# EAGLE design minimatrixV1-2 (EAGLE 5.11)
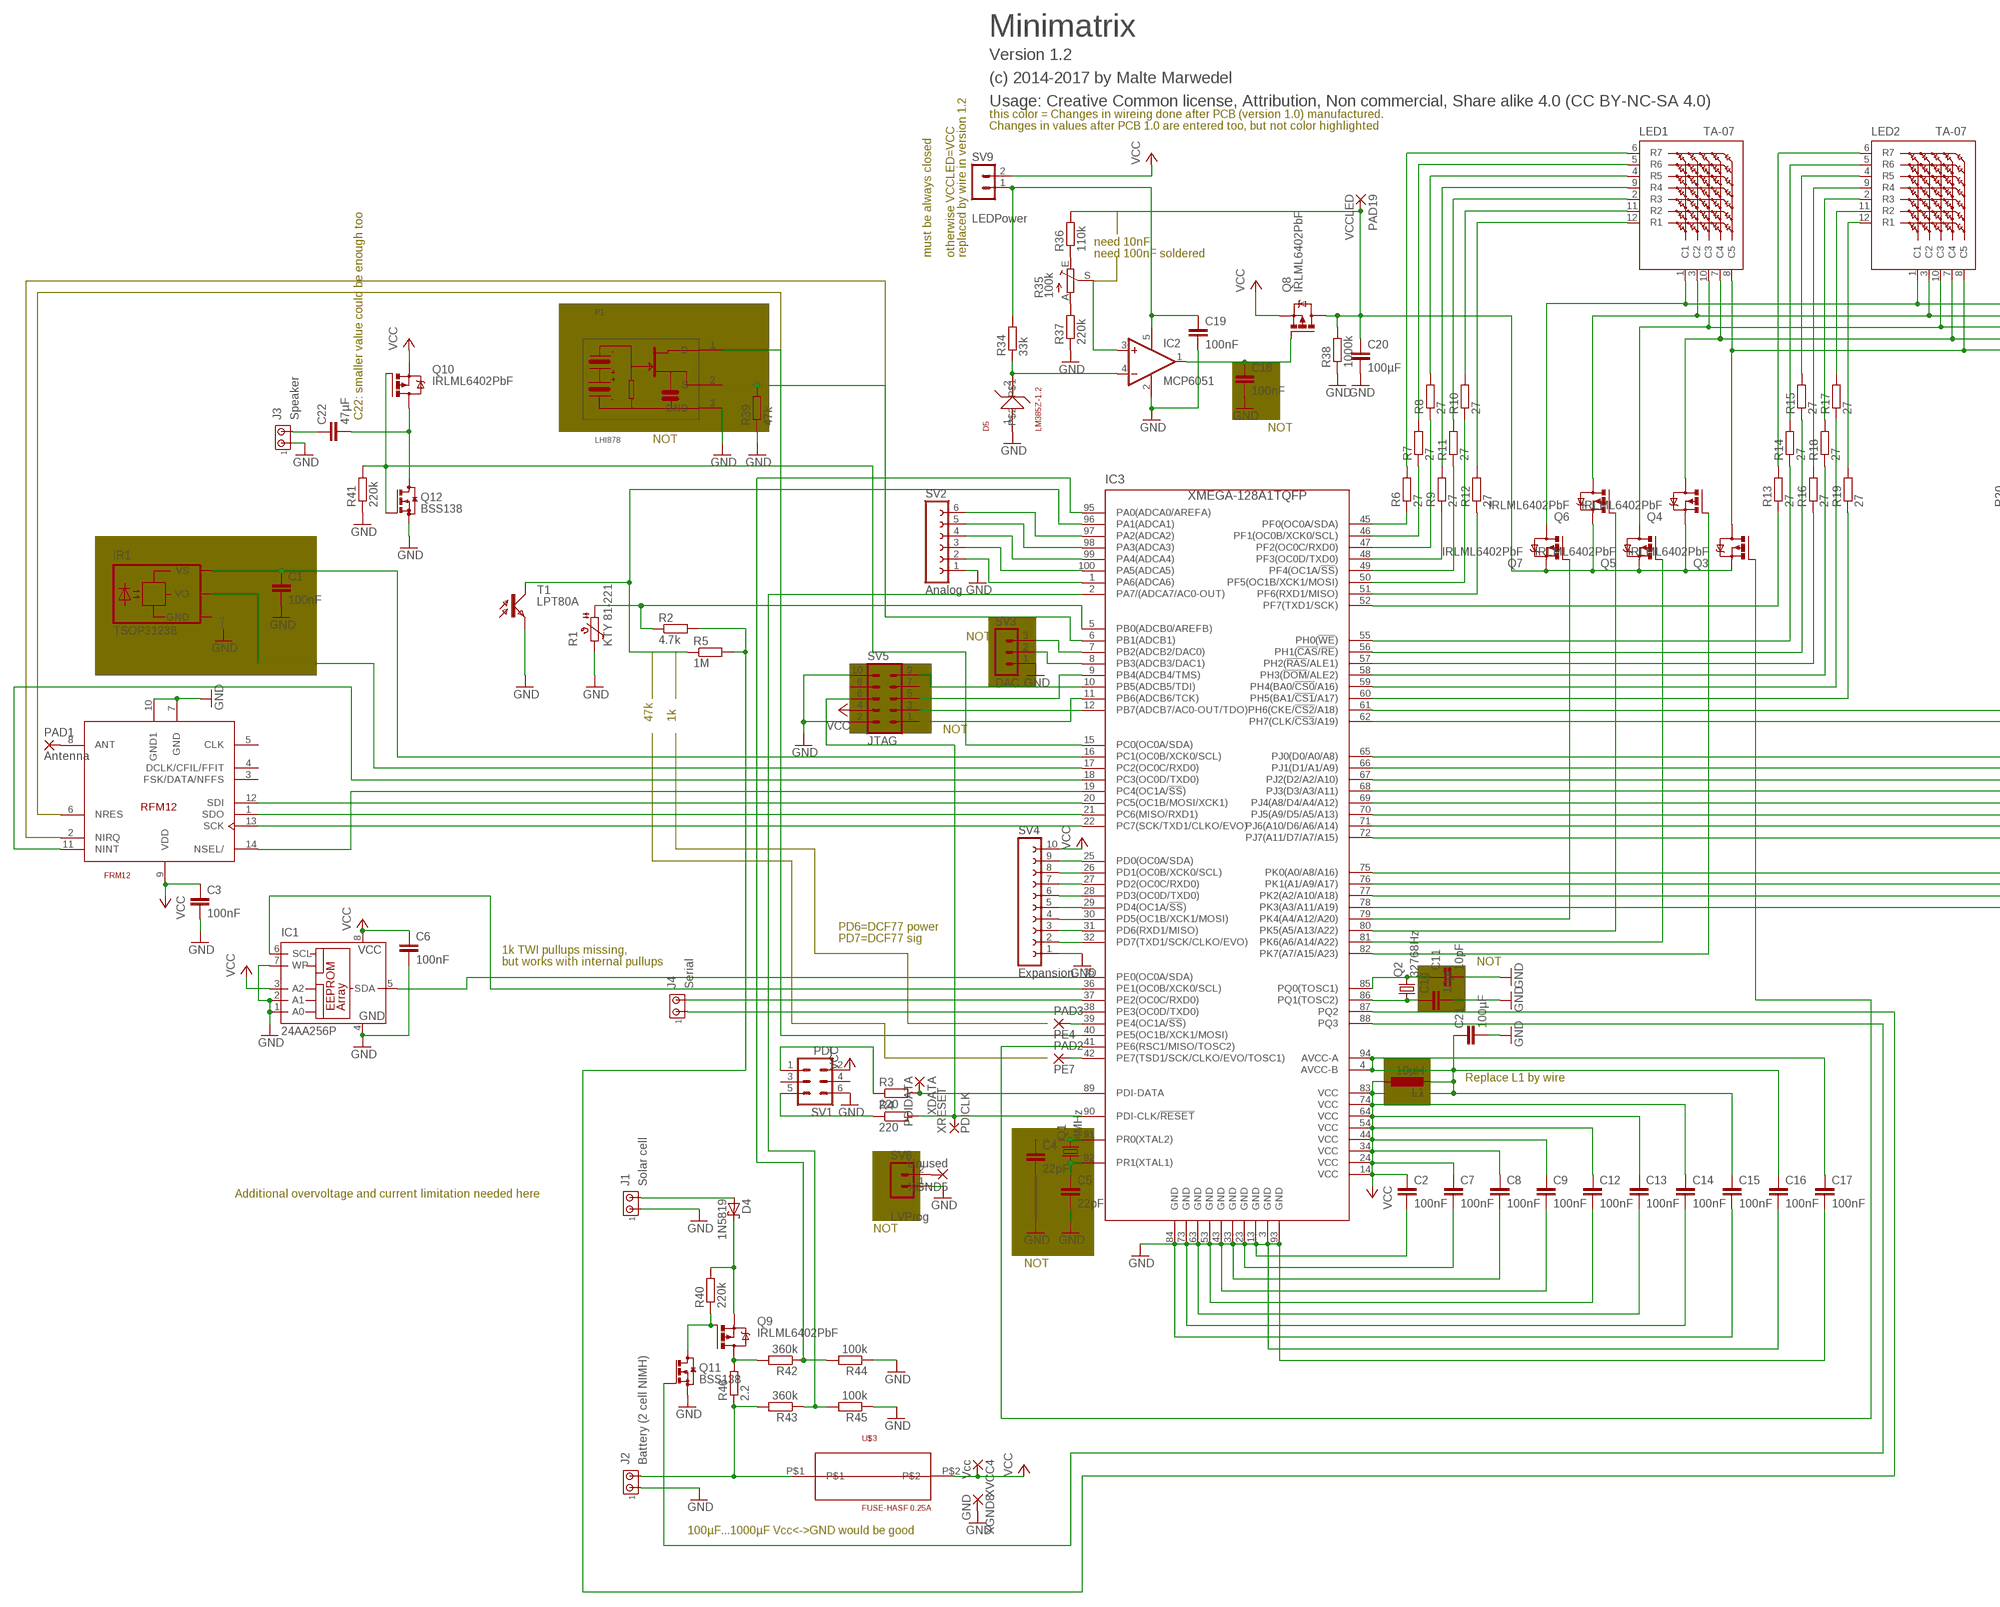
[diagram p0: schematic, sheet 1, part 1 of 2]
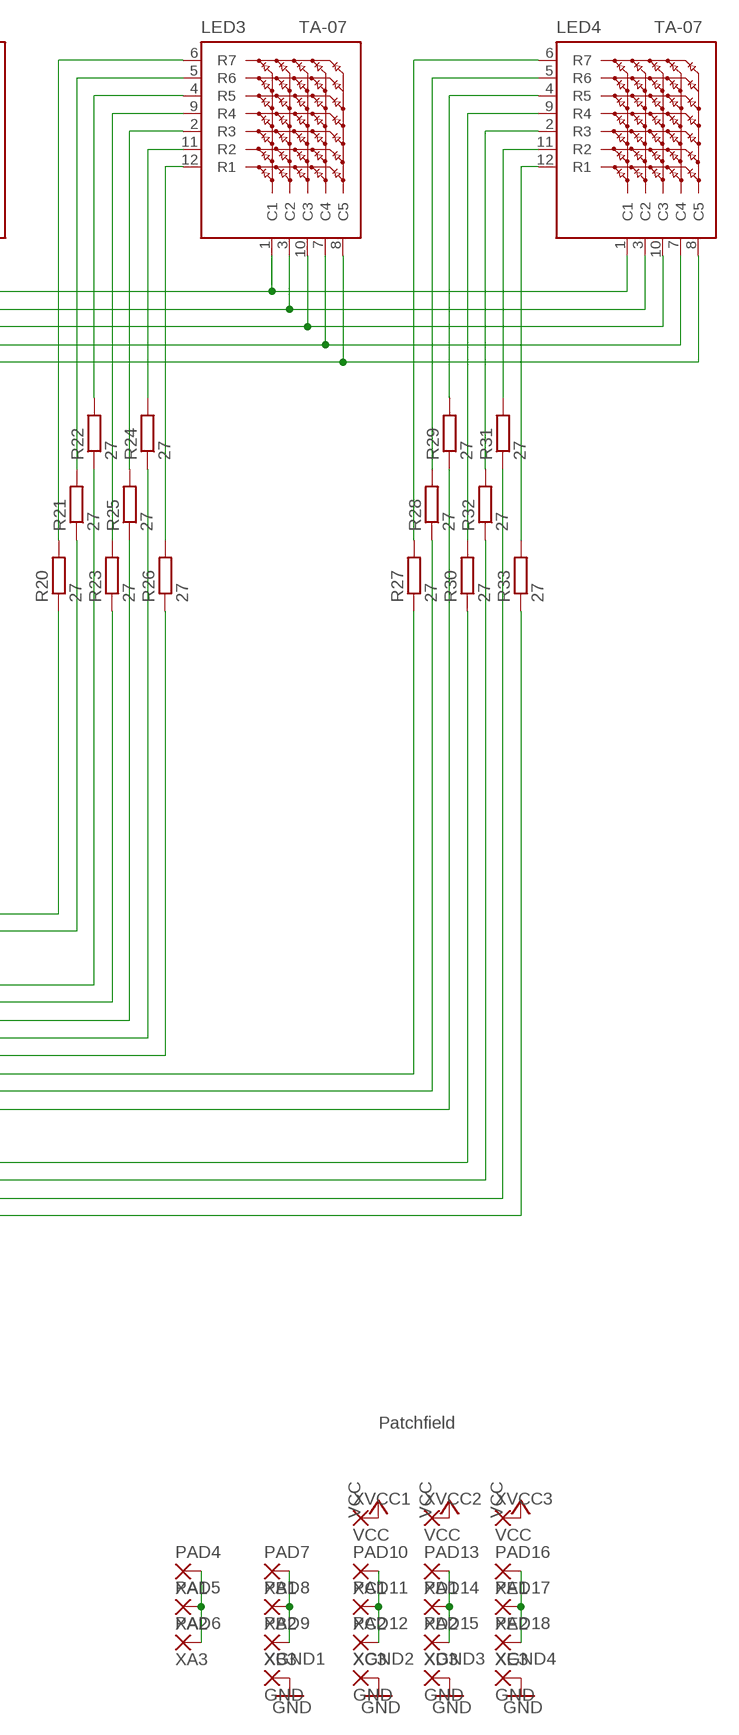
[diagram p1: schematic, sheet 1, part 2 of 2]

## Parts
C1  100nF  C-EUC0805  [C0805]
C2  100nF  C-EUC0805  [C0805]
C3  100nF  C-EUC0805  [C0805]
C4  22pF  C-EUC0805  [C0805]
C5  22pF  C-EUC0805  [C0805]
C6  100nF  C-EUC0805  [C0805]
C7  100nF  C-EUC0805  [C0805]
C8  100nF  C-EUC0805  [C0805]
C9  100nF  C-EUC0805  [C0805]
C10  10pF  C-EUC0805  [C0805]
C11  10pF  C-EUC0805  [C0805]
C12  100nF  C-EUC0805  [C0805]
C13  100nF  C-EUC0805  [C0805]
C14  100nF  C-EUC0805  [C0805]
C15  100nF  C-EUC0805  [C0805]
C16  100nF  C-EUC0805  [C0805]
C17  100nF  C-EUC0805  [C0805]
C18  100nF  C-EUC0805  [C0805]
C19  100nF  C-EUC0805  [C0805]
C20  100µF  C-EUC1206  [C1206]
C21  100µF  C-EUC1206  [C1206]
C22  47µF  C-EUC1206  [C1206]
D4  1N5819  1N5817-B  [DO41-7.6]
D5  LM385Z-1.2  LM258Z  [TO92L]
IC1  24AA256P  [DIL8]
IC2  MCP6051  MCP601OT  [SOT23-5]
IC3  XMEGA-128A1TQFP  XMEGA-A1TQFP  [TQFP100]
IR1  TSOP31238  TSOP17TB1HIGH  [TSOP17_ST]
J1  Solar cell  MTA02-100  [RM3.5X02MTA]
J2  Battery (2 cell NIMH)  MTA02-100  [RM3.5X02MTA]
J3  Speaker  MTA02-100  [RM3.5X02MTA]
J4  Serial  MTA02-100  [RM3.5X02MTA]
L1  10µH  L-EU0207/2V  [0207/2V]
LED1  TA-07  [TX07-11]
LED2  TA-07  [TX07-11]
LED3  TA-07  [TX07-11]
LED4  TA-07  [TX07-11]
P1  LHI878  [TO5]
PAD1  Antenna  1,6/0,8  [1,6/0,8]
PAD2  PE7  1,6/0,8  [1,6/0,8]
PAD3  PE4  1,6/0,8  [1,6/0,8]
PAD4  XA1  1,6/0,8  [1,6/0,8]
PAD5  XA2  1,6/0,8  [1,6/0,8]
PAD6  XA3  1,6/0,8  [1,6/0,8]
PAD7  XB1  1,6/0,8  [1,6/0,8]
PAD8  XB2  1,6/0,8  [1,6/0,8]
PAD9  XB3  1,6/0,8  [1,6/0,8]
PAD10  XC1  1,6/0,8  [1,6/0,8]
PAD11  XC2  1,6/0,8  [1,6/0,8]
PAD12  XC3  1,6/0,8  [1,6/0,8]
PAD13  XD1  1,6/0,8  [1,6/0,8]
PAD14  XD2  1,6/0,8  [1,6/0,8]
PAD15  XD3  1,6/0,8  [1,6/0,8]
PAD16  XE1  1,6/0,8  [1,6/0,8]
PAD17  XE2  1,6/0,8  [1,6/0,8]
PAD18  XE3  1,6/0,8  [1,6/0,8]
PAD19  VCCLED  1,6/0,8  [1,6/0,8]
Q1  4MHz  CRYSTALHC18U-V  [HC18U-V]
Q2  32768Hz  CRYSTALTC38H  [TC38H]
Q3  IRLML6402PbF  IRLML5203  [MICRO3]
Q4  IRLML6402PbF  IRLML5203  [MICRO3]
Q5  IRLML6402PbF  IRLML5203  [MICRO3]
Q6  IRLML6402PbF  IRLML5203  [MICRO3]
Q7  IRLML6402PbF  IRLML5203  [MICRO3]
Q8  IRLML6402PbF  IRLML5203  [MICRO3]
Q9  IRLML6402PbF  IRLML5203  [MICRO3]
Q10  IRLML6402PbF  IRLML5203  [MICRO3]
Q11  BSS138  BSS123  [SOT23]
Q12  BSS138  BSS123  [SOT23]
R1  KTY 81-221  PTC-SOD70  [SOD70]
R2  4.7k  R-EU_R0805  [R0805]
R3  220  R-EU_R0805  [R0805]
R4  220  R-EU_R0805  [R0805]
R5  1M  R-EU_R0805  [R0805]
R6  27  R-EU_R0805  [R0805]
R7  27  R-EU_R0805  [R0805]
R8  27  R-EU_R0805  [R0805]
R9  27  R-EU_R0805  [R0805]
R10  27  R-EU_R0805  [R0805]
R11  27  R-EU_R0805  [R0805]
R12  27  R-EU_R0805  [R0805]
R13  27  R-EU_R0805  [R0805]
R14  27  R-EU_R0805  [R0805]
R15  27  R-EU_R0805  [R0805]
R16  27  R-EU_R0805  [R0805]
R17  27  R-EU_R0805  [R0805]
R18  27  R-EU_R0805  [R0805]
R19  27  R-EU_R0805  [R0805]
R20  27  R-EU_R0805  [R0805]
R21  27  R-EU_R0805  [R0805]
R22  27  R-EU_R0805  [R0805]
R23  27  R-EU_R0805  [R0805]
R24  27  R-EU_R0805  [R0805]
R25  27  R-EU_R0805  [R0805]
R26  27  R-EU_R0805  [R0805]
R27  27  R-EU_R0805  [R0805]
R28  27  R-EU_R0805  [R0805]
R29  27  R-EU_R0805  [R0805]
R30  27  R-EU_R0805  [R0805]
R31  27  R-EU_R0805  [R0805]
R32  27  R-EU_R0805  [R0805]
R33  27  R-EU_R0805  [R0805]
R34  33k  R-EU_R0805  [R0805]
R35  100k  TRIM_EU-CA6H  [CA6H]
R36  110k  R-EU_R0805  [R0805]
R37  220k  R-EU_R0805  [R0805]
R38  1000k  R-EU_R0805  [R0805]
R39  47k  R-EU_R0805  [R0805]
R40  220k  R-EU_R0805  [R0805]
R41  220k  R-EU_R0805  [R0805]
R42  360k  R-EU_R0805  [R0805]
R43  360k  R-EU_R0805  [R0805]
R44  100k  R-EU_R0805  [R0805]
R45  100k  R-EU_R0805  [R0805]
R46  2.2  R-EU_0414/15  [0414/15]
SV1  PDI  MA03-2  [MA03-2]
SV2  Analog  FE06-1  [FE06]
SV3  DAC  MA03-1  [MA03-1]
SV4  Expansion  FE10-1  [FE10]
SV5  JTAG  MA05-2  [MA05-2]
SV8  LVProg  MA02-1  [MA02-1]
SV9  LEDPower  MA02-1  [MA02-1]
T1  LPT80A  [LPT80A]
U$2  FRM12  [RFM12]
U$3  FUSE-HASF 0.25A  FUSE-HASF  [FUSE-SMD-HASF]
XDATA  PDIDATA  1,6/0,8  [1,6/0,8]
XGND1  GND  1,6/0,8  [1,6/0,8]
XGND2  GND  1,6/0,8  [1,6/0,8]
XGND3  GND  1,6/0,8  [1,6/0,8]
XGND4  GND  1,6/0,8  [1,6/0,8]
XGND5  Unused  1,6/0,8  [1,6/0,8]
XGND8  GND  1,6/0,8  [1,6/0,8]
XRESET  PDICLK  1,6/0,8  [1,6/0,8]
XVCC1  VCC  1,6/0,8  [1,6/0,8]
XVCC2  VCC  1,6/0,8  [1,6/0,8]
XVCC3  VCC  1,6/0,8  [1,6/0,8]
XVCC4  Vcc  1,6/0,8  [1,6/0,8]

## Nets
GND: C1.2 C2.2 C3.2 C4.2 C5.2 C6.2 C7.2 C8.2 C9.2 C10.2 C11.2 C12.2 C13.2 C14.2 C15.2 C16.2 C17.2 C18.2 C19.2 C20.2 C21.2 D5.1 IC1.1(A0) IC1.2(A1) IC1.4(GND) IC1.7(WP) IC2.2(V-) IC3.3(GND) IC3.13(GND) IC3.23(GND) IC3.33(GND) IC3.43(GND) IC3.53(GND) IC3.63(GND) IC3.73(GND) IC3.84(GND) IC3.93(GND) IR1.GND J1.1 J2.1 J3.1 P1.3(GND) Q11.2(S) Q12.2(S) R1.2 R37.1 R38.1 R39.1 R41.1 R44.1 R45.1 SV1.6 SV2.1 SV3.1 SV4.1 SV5.2 SV5.10 SV8.1 T1.E U$2.7(GND) U$2.10(GND1) XGND1.1(P) XGND2.1(P) XGND3.1(P) XGND4.1(P) XGND8.1(P)
N$1: IC3.20(PC5(OC1B/MOSI/XCK1)) U$2.12(SDI)
N$2: IC3.21(PC6(MISO/RXD1)) U$2.1(SDO)
N$3: IC3.22(PC7(SCK/TXD1/CLKO/EVO)) U$2.13(SCK)
N$4: IC3.19(PC4(OC1A/!SS!)) U$2.14(NSEL/)
N$5: IC3.18(PC3(OC0D/TXD0)) U$2.11(NINT)
N$6: C1.1 IC3.16(PC1(OC0B/XCK0/SCL)) IR1.VS
N$7: PAD1.1(P) U$2.8(ANT)
N$8: IC3.17(PC2(OC0C/RXD0)) IR1.VO
N$9: R3.1 SV1.1
N$10: IC3.89(PDI-DATA) R3.2 XDATA.1(P)
N$11: IC3.87(PQ2) R2.2 R5.2
N$12: C4.1 IC3.91(PR0(XTAL2)) Q1.2
N$13: C5.1 IC3.92(PR1(XTAL1)) Q1.1
N$14: IC3.79(PK4(A4/A12/A20)) Q7.1(G)
N$15: IC1.5(SDA) IC3.35(PE0(OC0A/SDA))
N$16: IC1.6(SCL) IC3.36(PE1(OC0B/XCK0/SCL))
N$17: IC3.5(PB0(ADCB0/AREFB)) R1.1 R2.1
N$18: IC3.90(PDI-CLK/!RESET) R4.2 SV5.6 XRESET.1(P)
N$19: R4.1 SV1.5
N$20: C11.1 IC3.85(PQ0(TOSC1)) Q2.2
N$21: C10.1 IC3.86(PQ1(TOSC2)) Q2.1
N$22: IC3.97(PA2(ADCA2)) SV2.6
N$23: IC3.98(PA3(ADCA3)) SV2.5
N$24: IC3.99(PA4(ADCA4)) SV2.4
N$25: IC3.100(PA5(ADCA5)) SV2.3
N$26: IC3.1(PA6(ADCA6)) SV2.2
N$27: IC3.96(PA1(ADCA1)) R5.1 T1.C
N$28: LED1.1(C1) LED2.1(C1) LED3.1(C1) LED4.1(C1) Q7.3(D)
N$29: IC3.9(PB4(ADCB4/TMS)) SV5.5
N$30: IC3.10(PB5(ADCB5/TDI)) SV5.9
N$31: IC3.11(PB6(ADCB6/TCK)) SV5.1
N$32: IC3.12(PB7(ADCB7/AC0-OUT/TDO)) SV5.3
N$33: LED1.3(C2) LED2.3(C2) LED3.3(C2) LED4.3(C2) Q6.3(D)
N$34: LED1.10(C3) LED2.10(C3) LED3.10(C3) LED4.10(C3) Q5.3(D)
N$35: LED1.7(C4) LED2.7(C4) LED3.7(C4) LED4.7(C4) Q4.3(D)
N$36: LED1.8(C5) LED2.8(C5) LED3.8(C5) LED4.8(C5) Q3.3(D)
N$37: LED1.6(R7) R6.2
N$38: LED1.5(R6) R7.2
N$39: LED1.4(R5) R8.2
N$40: LED1.9(R4) R9.2
N$41: LED1.2(R3) R11.2
N$42: LED1.11(R2) R10.2
N$43: LED1.12(R1) R12.2
N$44: IC3.50(PF5(OC1B/XCK1/MOSI)) R10.1
N$45: IC3.48(PF3(OC0D/TXD0)) R9.1
N$46: IC3.46(PF1(OC0B/XCK0/SCL)) R7.1
N$47: IC3.45(PF0(OC0A/SDA)) R6.1
N$48: IC3.47(PF2(OC0C/RXD0)) R8.1
N$49: IC3.49(PF4(OC1A/!SS!)) R11.1
N$50: IC3.51(PF6(RXD1/MISO)) R12.1
N$51: LED2.6(R7) R13.2
N$52: LED2.5(R6) R14.2
N$53: LED2.4(R5) R15.2
N$54: LED2.9(R4) R16.2
N$55: LED2.2(R3) R18.2
N$56: LED2.11(R2) R17.2
N$57: LED2.12(R1) R19.2
N$58: IC3.59(PH4(BA0/!CS0!/A16)) R17.1
N$59: IC3.57(PH2(!RAS!/ALE1)) R16.1
N$60: IC3.55(PH0(!WE!)) R14.1
N$61: IC3.52(PF7(TXD1/SCK)) R13.1
N$62: IC3.56(PH1(!CAS!/!RE!)) R15.1
N$63: IC3.58(PH3(!DOM!/ALE2)) R18.1
N$64: IC3.60(PH5(BA1/!CS1!/A17)) R19.1
N$65: J2.2 R43.2 R46.1 U$3.P$1
N$66: LED3.6(R7) R20.2
N$67: LED3.5(R6) R21.2
N$68: LED3.4(R5) R22.2
N$69: LED3.9(R4) R23.2
N$70: LED3.2(R3) R25.2
N$71: LED3.11(R2) R24.2
N$72: LED3.12(R1) R26.2
N$73: IC3.68(PJ3(D3/A3/A11)) R24.1
N$74: IC3.66(PJ1(D1/A1/A9)) R23.1
N$75: IC3.62(PH7(CLK/!CS3!/A19)) R21.1
N$76: IC3.61(PH6(CKE/!CS2!/A18)) R20.1
N$77: IC3.65(PJ0(D0/A0/A8)) R22.1
N$78: IC3.67(PJ2(D2/A2/A10)) R25.1
N$79: IC3.69(PJ4(A8/D4/A4/A12)) R26.1
N$80: LED4.6(R7) R27.2
N$81: LED4.5(R6) R28.2
N$82: LED4.4(R5) R29.2
N$83: LED4.9(R4) R30.2
N$84: LED4.2(R3) R32.2
N$85: LED4.11(R2) R31.2
N$86: LED4.12(R1) R33.2
N$87: IC3.77(PK2(A2/A10/A18)) R31.1
N$88: IC3.75(PK0(A0/A8/A16)) R30.1
N$89: IC3.71(PJ6(A10/D6/A6/A14)) R28.1
N$90: IC3.70(PJ5(A9/D5/A5/A13)) R27.1
N$91: IC3.72(PJ7(A11/D7/A7/A15)) R29.1
N$92: IC3.76(PK1(A1/A9/A17)) R32.1
N$93: IC3.78(PK3(A3/A11/A19)) R33.1
N$94: D4.A J1.2
N$95: IC3.80(PK5(A5/A13/A22)) Q6.1(G)
N$96: C20.1 PAD19.1(P) Q3.2(S) Q4.2(S) Q5.2(S) Q6.2(S) Q7.2(S) Q8.3(D) R36.2 R38.2
N$97: IC3.81(PK6(A6/A14/A22)) Q5.1(G)
N$98: IC3.82(PK7(A7/A15/A23)) Q4.1(G)
N$99: IC3.41(PE6(RSC1/MISO/TOSC2)) Q3.1(G)
N$100: C18.1 IC2.1(OUT) Q8.1(G)
N$101: D5.2 IC2.4(-IN) R34.1
N$102: R35.E R36.1
N$103: R35.A R37.2
N$104: IC3.6(PB1(ADCB1)) P1.2(S) R39.2
N$105: IC2.3(+IN) R35.S
N$106: IC3.40(PE5(OC1B/XCK1/MOSI)) P1.1(D)
N$107: IC3.25(PD0(OC0A/SDA)) SV4.9
N$108: IC3.26(PD1(OC0B/XCK0/SCL)) SV4.8
N$109: IC3.27(PD2(OC0C/RXD0)) SV4.7
N$110: IC3.28(PD3(OC0D/TXD0)) SV4.6
N$111: IC3.29(PD4(OC1A/!SS!)) SV4.5
N$112: IC3.30(PD5(OC1B/XCK1/MOSI)) SV4.4
N$113: IC3.31(PD6(RXD1/MISO)) SV4.3
N$114: IC3.32(PD7(TXD1/SCK/CLKO/EVO)) SV4.2
N$115: D4.C Q9.2(S) R40.2
N$116: Q9.1(G) Q11.3(D) R40.1
N$117: Q9.3(D) R42.2 R46.2
N$118: IC3.2(PA7/(ADCA7/AC0-OUT)) R43.1 R45.2
N$119: IC3.95(PA0(ADCA0/AREFA)) R42.1 R44.2
N$120: IC3.37(PE2(OC0C/RXD0)) J4.2
N$121: IC3.38(PE3(OC0D/TXD0)) J4.1
N$122: IC3.42(PE7(TSD1/SCK/CLKO/EVO/TOSC1)) PAD2.1(P)
N$123: IC3.88(PQ3) Q11.1(G)
N$124: C22.2 Q10.3(D) Q12.3(D)
N$125: IC3.15(PC0(OC0A/SDA)) Q10.1(G) Q12.1(G) R41.2
N$126: C22.1 J3.2
N$127: IC3.39(PE4(OC1A/!SS!)) PAD3.1(P)
N$128: IC3.7(PB2(ADCB2/DAC0)) SV3.3
N$129: IC3.8(PB3(ADCB3/DAC1)) SV3.2
N$131: SV8.2 XGND5.1(P)
N$132: C19.1 IC2.5(V+) R34.2 SV9.1
N$156: PAD4.1(P) PAD5.1(P) PAD6.1(P)
N$157: PAD7.1(P) PAD8.1(P) PAD9.1(P)
N$158: PAD10.1(P) PAD11.1(P) PAD12.1(P)
N$159: PAD13.1(P) PAD14.1(P) PAD15.1(P)
N$160: PAD16.1(P) PAD17.1(P) PAD18.1(P)
VCC: C2.1 C3.1 C6.1 C7.1 C8.1 C9.1 C12.1 C13.1 C14.1 C15.1 C16.1 C17.1 C21.1 IC1.3(A2) IC1.8(VCC) IC3.4(AVCC-B) IC3.14(VCC) IC3.24(VCC) IC3.34(VCC) IC3.44(VCC) IC3.54(VCC) IC3.64(VCC) IC3.74(VCC) IC3.83(VCC) IC3.94(AVCC-A) L1.1 L1.2 Q8.2(S) Q10.2(S) SV1.2 SV4.10 SV5.4 SV9.2 U$2.9(VDD) U$3.P$2 XVCC1.1(P) XVCC2.1(P) XVCC3.1(P) XVCC4.1(P)
Unconnected: SV1.3 SV1.4 SV5.7 SV5.8 U$2.2(NIRQ) U$2.3(FSK/DATA/NFFS) U$2.4(DCLK/CFIL/FFIT) U$2.5(CLK) U$2.6(NRES)

## Notes on the sheet
- Minimatrix
- Version 1.2
- (c) 2014-2017 by Malte Marwedel
- Usage: Creative Common license, Attribution, Non commercial, Share alike 4.0 (CC BY-NC-SA 4.0)
- this color = Changes in wireing done after PCB (version 1.0) manufactured.
- Changes in values after PCB 1.0 are entered too, but not color highlighted
- need 10nF
- must be always closed | otherwise VCCLED=VCC | replaced by wire in version 1.2 | need 100nF soldered
- C22: smaller value could be enough too
- NOT
- NOT
- NOT
- 47k | 1k
- NOT
- PD6=DCF77 power
- PD7=DCF77 sig
- 1k TWI pullups missing,
- but works with internal pullups | NOT
- Patchfield
- Replace L1 by wire
- Additional overvoltage and current limitation needed here
- NOT
- NOT
- 100µF...1000µF Vcc<->GND would be good

## Library data of the parts
C1-C22 = rcl:C-EU: CAPACITOR, European symbol
D4 = diode:1N581*: 1.0A SCHOTTKY BARRIER RECTIFIER Source: http://www.diodes.com/datasheets/ds23001.pdf
D5 = maltes2_lib:LM258Z: LM185Z / LM285Z / LM385Z Micropower voltage reference diode LM285Z-1.2 -> 1,25V ref voltage.
IC1 = microchip:24*: Serial EEPROM I2C; MF: MICROCHIP; MPN: 24AA256-I/P; OC_FARNELL: 1331294; OC_NEWARK: 92C6872
IC2 = linear:MCP601: Single Op Amp 2.7V to 6.0V Single Supply CMOS Source: http://ww1.microchip.com/downloads/en/DeviceDoc/21314g.pdf
IC3 = avr-7:XMEGA-A1: Atmel XMega A1 Series processor
IR1 = maltes_lib:TSOP17*TB1: TSOP17..TB1 IR Receiver Modules for Remote Control Systems Source: http://www.vishay.com/docs/82042/82042.pdf
J1-J4 = maltes2_lib:MTA02-100: AMP connector; OC_FARNELL: unknown; OC_NEWARK: unknown
L1 = rcl:L-EU: INDUCTOR, European symbol
LED1-LED4 = maltes2_lib:TA-07: 18mm (0.7 INCH) 5x7 DOT MATRIX DISPLAY
P1 = maltes2_lib:LHI878: LHI 878 PIR Sensor
PAD1-PAD19 XDATA XGND1-XGND5 XGND8 XRESET XVCC1-XVCC4 = wirepad:1,6/0,8: THROUGH-HOLE PAD
Q1 Q2 = crystal:CRYSTAL: CRYSTAL; OC_FARNELL: unknown; OC_NEWARK: unknown
Q3-Q10 = transistor-power:IRLML5203: HEXFET P-Channel Power MOSFET
Q11 Q12 = transistor-small-signal:BSS123: N-CHANNEL MOS FET
R1 = ptc-ntc:PTC-: Positive Temperature Coefficient Resistor (PTC) termistor Philips KTY81-210 - KTY81-252 Source: 153627-da-01-en-Temperatur-Sensor_KTY10-6_Philips.pdf; OC_FARNELL: unknown; OC_NEWARK: unknown
R2-R34 R36-R46 = rcl:R-EU_: RESISTOR, European symbol
R35 = maltes2_lib:TRIM_EU-: POTENTIOMETER
SV1 = con-lstb:MA03-2: PIN HEADER; OC_FARNELL: unknown; OC_NEWARK: unknown
SV2 = con-lsta:FE06-1: FEMALE HEADER; OC_FARNELL: unknown; OC_NEWARK: unknown
SV3 = con-lstb:MA03-1: PIN HEADER; OC_FARNELL: unknown; OC_NEWARK: unknown
SV4 = con-lsta:FE10-1: FEMALE HEADER; OC_FARNELL: unknown; OC_NEWARK: unknown
SV5 = con-lstb:MA05-2: PIN HEADER; OC_FARNELL: unknown; OC_NEWARK: unknown
SV8 SV9 = maltes_lib:MA02-1: PIN HEADER
T1 = opto-trans-siemens:LPT80A: PHOTO TRANSISTOR; OC_FARNELL: unknown; OC_NEWARK: unknown
U$2 = RFM12:FRM12
U$3 = maltes_lib:FUSE-HASF

## Board
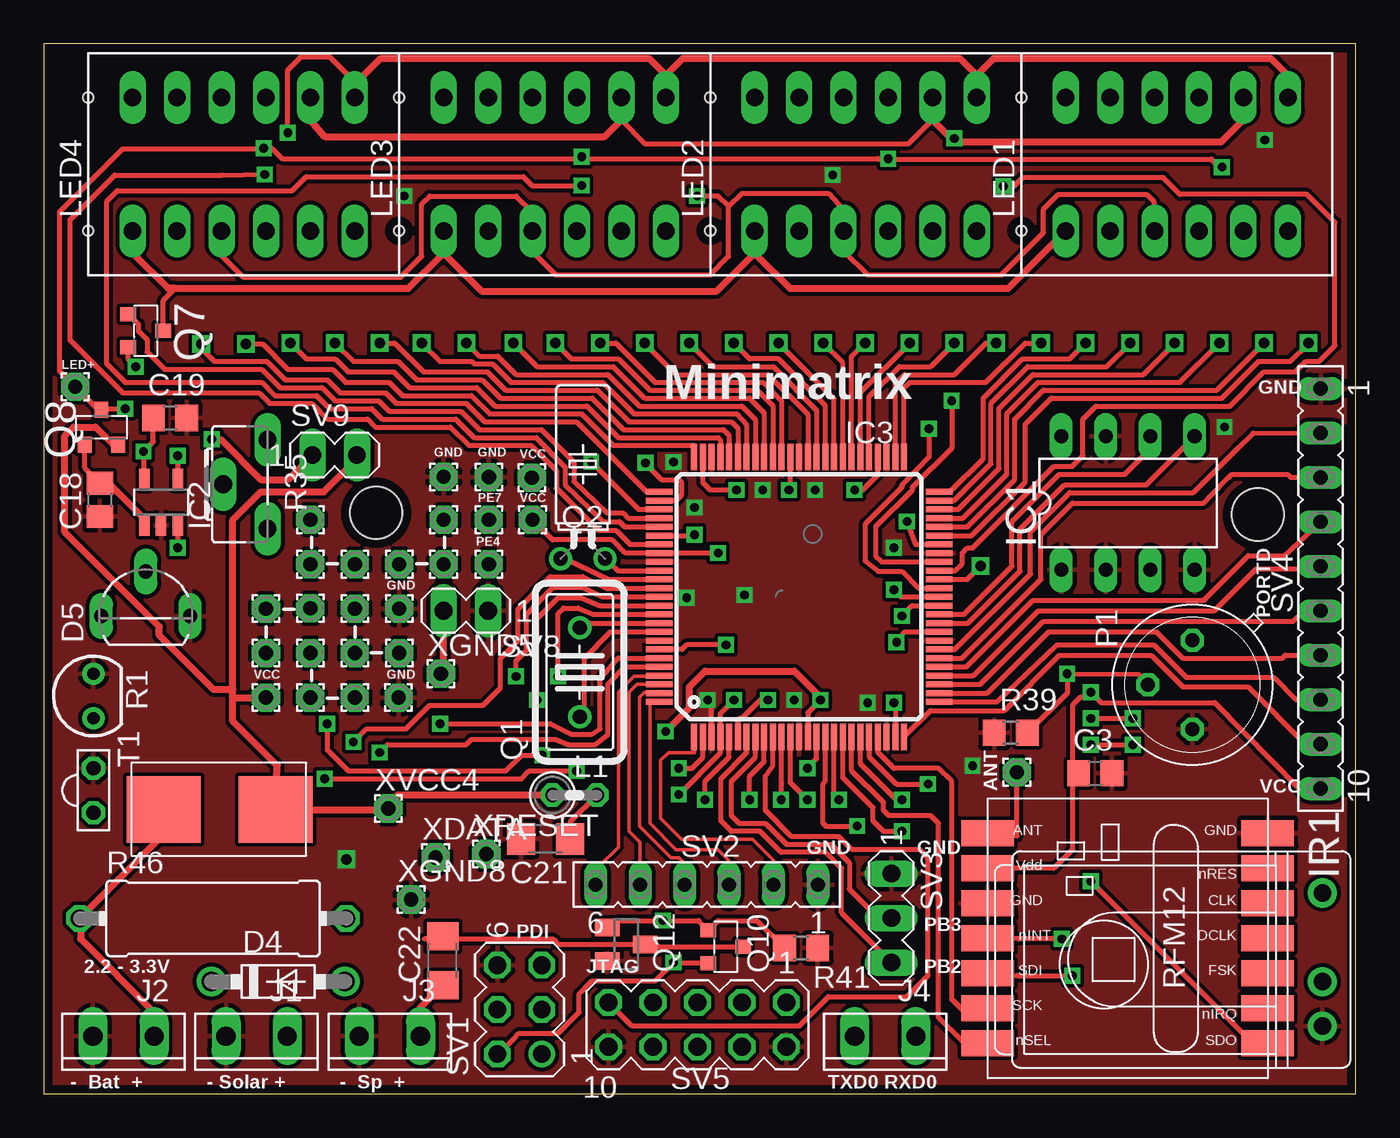
[diagram p2: board, top side]
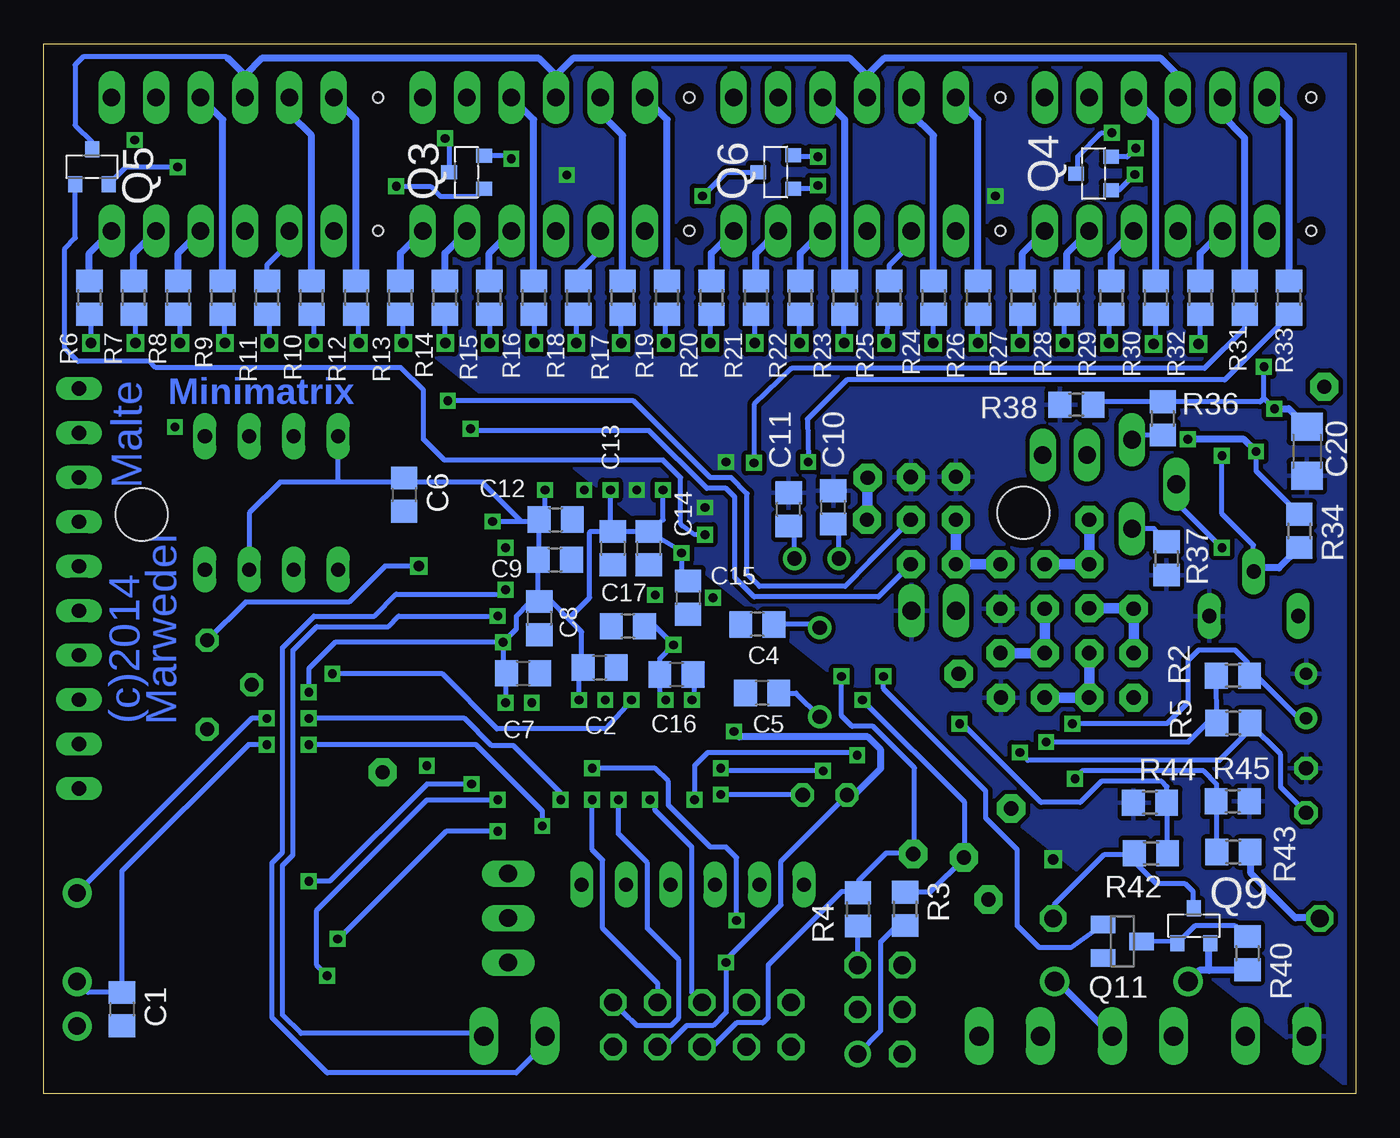
[diagram p3: board, bottom side, seen from below]

Size 75 x 60 mm. Coordinates in mm from the lower left corner, seen from the top.
Outline: 0,0 75,0 75,60 0,60 0,0
Copper layers (1*16): Top 0.035mm / dielectric 1.5mm / Bottom 0.035mm
Design rules "myDefaultThin-2014-01-16": minimum track width 0.2mm, minimum drill 0.3mm, track to track 0.15mm, track to pad 0.15mm, pad to pad 0.15mm, via to via 0.2mm, smd to smd 0.15mm, copper to edge 0.5mm, drill to drill 1mm, minimum pad ring 10mil, minimum via ring 8mil, stop-mask expansion 4mil, vias tented up to drill 0mil, thermal gap 10mil
Holes 3 mm at 69.4,33.1 19,33.2

### Footprints (pad centres in the part's own frame; a part is rotated, then mirrored left to right if it is on the bottom)
C0805 = smd 1.3 x 1.5: 1 -0.95,0; 2 0.95,0
C1206 = smd 1.6 x 1.8: 1 -1.4,0; 2 1.4,0
DO41-7.6 = drill 1.1 pad 1.7 round: A 3.81,0; C -3.81,0
TO92L = drill 0.813 long: 1 0,-2.54; 2 2.54,0; 3 0,2.54
DIL8 = drill 0.813 long: 1 -3.81,-3.81; 2 -1.27,-3.81; 3 1.27,-3.81; 4 3.81,-3.81; 5 3.81,3.81; 6 1.27,3.81; 7 -1.27,3.81; 8 -3.81,3.81
SOT23-5 = smd 0.6 x 1.2: 1 -0.95,-1.306; 2 0,-1.306; 3 0.95,-1.306; 4 0.95,1.306; 5 -0.95,1.306
TQFP100 = smd 1.5 x 0.35: 1 -8,6; 2 -8,5.5; 3 -8,5; 4 -8,4.5; 5 -8,4; 6 -8,3.5; 7 -8,3; 8 -8,2.5; 9 -8,2; 10 -8,1.5; 11 -8,1; 12 -8,0.5; 13 -8,0; 14 -8,-0.5; 15 -8,-1; 16 -8,-1.5; 17 -8,-2; 18 -8,-2.5; 19 -8,-3; 20 -8,-3.5; 21 -8,-4; 22 -8,-4.5; 23 -8,-5; 24 -8,-5.5; 25 -8,-6; 51 8,-6; 52 8,-5.5; 53 8,-5; 54 8,-4.5; 55 8,-4; 56 8,-3.5; 57 8,-3; 58 8,-2.5; 59 8,-2; 60 8,-1.5; 61 8,-1; 62 8,-0.5; 63 8,0; 64 8,0.5; 65 8,1; 66 8,1.5; 67 8,2; 68 8,2.5; 69 8,3; 70 8,3.5; 71 8,4; 72 8,4.5; 73 8,5; 74 8,5.5; 75 8,6 | smd 0.35 x 1.5: 26 -6,-8; 27 -5.5,-8; 28 -5,-8; 29 -4.5,-8; 30 -4,-8; 31 -3.5,-8; 32 -3,-8; 33 -2.5,-8; 34 -2,-8; 35 -1.5,-8; 36 -1,-8; 37 -0.5,-8; 38 0,-8; 39 0.5,-8; 40 1,-8; 41 1.5,-8; 42 2,-8; 43 2.5,-8; 44 3,-8; 45 3.5,-8; 46 4,-8; 47 4.5,-8; 48 5,-8; 49 5.5,-8; 50 6,-8; 76 6,8; 77 5.5,8; 78 5,8; 79 4.5,8; 80 4,8; 81 3.5,8; 82 3,8; 83 2.5,8; 84 2,8; 85 1.5,8; 86 1,8; 87 0.5,8; 88 0,8; 89 -0.5,8; 90 -1,8; 91 -1.5,8; 92 -2,8; 93 -2.5,8; 94 -3,8; 95 -3.5,8; 96 -4,8; 97 -4.5,8; 98 -5,8; 99 -5.5,8; 100 -6,8
TSOP17_ST = drill 1 pad 1.676 round: GND 0,-5.08; VO 0,2.54; VS 0,-2.54
RM3.5X02MTA = drill 1.1 long: 1 1.75,0; 2 -1.75,0
0207/2V = drill 0.813 octagon: 1 -1.27,0; 2 1.27,0
TX07-11 = drill 1 long: 1 -6.35,-3.81; 2 -3.81,-3.81; 3 -1.27,-3.81; 4 1.27,-3.81; 5 3.81,-3.81; 6 6.35,-3.81; 7 6.35,3.81; 8 3.81,3.81; 9 1.27,3.81; 10 -1.27,3.81; 11 -3.81,3.81; 12 -6.35,3.81 | hole 0.6: -8.89,3.81; -8.89,-3.81
TO5 = drill 0.813 octagon: 1 0,-2.54; 2 2.54,0; 3 0,2.54
1,6/0,8 = drill 0.813 pad 1.6 octagon: 1 0,0
HC18U-V = drill 0.813 round: 1 -2.54,0; 2 2.54,0
TC38H = drill 0.813 round: 1 -1.27,0; 2 1.27,0
MICRO3 = smd 0.8 x 0.9: 1 -0.95,-1; 2 0.95,-1; 3 0,1
SOT23 = smd 1 x 1.4: 1 -0.95,-1.1; 2 0.95,-1.1; 3 0,1.1
SOD70 = drill 0.7 pad 1.27 round: 1 -1.27,0; 2 1.27,0
R0805 = smd 1.3 x 1.5: 1 -0.95,0; 2 0.95,0
CA6H = drill 1.016 long: A -2.54,0; E 2.54,0; S 0,2.54
0414/15 = drill 1.016 octagon: 1 -7.62,0; 2 7.62,0
MA03-2 = drill 1.016 round: 1 -2.54,-1.27 | drill 1.016 octagon: 2 -2.54,1.27; 3 0,-1.27; 4 0,1.27; 5 2.54,-1.27; 6 2.54,1.27
FE06 = drill 0.813 long: 1 -6.35,0; 2 -3.81,0; 3 -1.27,0; 4 1.27,0; 5 3.81,0; 6 6.35,0
MA03-1 = drill 1.016 long: 1 -2.54,0; 2 0,0; 3 2.54,0
FE10 = drill 0.813 long: 1 -11.43,0; 2 -8.89,0; 3 -6.35,0; 4 -3.81,0; 5 -1.27,0; 6 1.27,0; 7 3.81,0; 8 6.35,0; 9 8.89,0; 10 11.43,0
MA05-2 = drill 1.016 octagon: 1 -5.08,-1.27; 2 -5.08,1.27; 3 -2.54,-1.27; 4 -2.54,1.27; 5 0,-1.27; 6 0,1.27; 7 2.54,-1.27; 8 2.54,1.27; 9 5.08,-1.27; 10 5.08,1.27
MA02-1 = drill 1.016 long: 1 -2.54,0; 2 0,0
LPT80A = drill 0.813 octagon: C 0,-1.27; E 0,1.27
RFM12 = smd 1.5 x 3: 1 -5,-10; 2 -3,-10; 3 -1,-10; 4 1,-10; 5 3,-10; 6 5,-10; 7 7,-10; 8 7,6; 9 5,6; 10 3,6; 11 1,6; 12 -1,6; 13 -3,6; 14 -5,6
FUSE-SMD-HASF = smd 4.24 x 3.81: P$1 -3.15,-0.05; P$2 3.24,-0.05

### Placement (x,y rotation side)
C1  70.53,4.84 270 bottom
C2  43.22,24.36 0 bottom
C3  60.11,18.32 0 top
C4  34.21,26.82 180 bottom
C5  33.93,22.9 180 bottom
C6  54.4,34.23 270 bottom
C7  47.59,24.03 0 bottom
C8  46.67,27.18 270 bottom
C9  45.78,30.52 0 bottom
C10  29.87,33.51 90 bottom
C11  32.42,33.4 90 bottom
C12  45.74,32.81 0 bottom
C13  42.47,31.18 270 bottom
C14  40.42,31.18 270 bottom
C15  38.17,28.35 270 bottom
C16  38.83,23.96 0 bottom
C17  41.6,26.72 180 bottom
C18  3.21,33.94 270 top
C19  7.22,38.62 0 top
C20  2.79,36.71 270 bottom
C21  28.69,14.56 180 top
C22  22.8,7.61 90 top
D4  13.4,6.41 0 top
D5  5.83,27.3 90 top
IC1  61.98,33.76 0 top
IC2  6.71,33.8 0 top
IC3  43.18,28.39 90 top
IR1  73.09,8.94 0 top
J1  12.17,3.29 180 top
J2  4.56,3.29 180 top
J3  19.78,3.29 180 top
J4  48.1,3.29 180 top
L1  30.35,17.07 0 top
LED1  64.77,53.12 0 top
LED2  46.99,53.12 0 top
LED3  29.21,53.12 0 top
LED4  11.43,53.12 0 top
P1  65.66,23.37 180 top
PAD1  55.63,18.37 0 top
PAD2  25.44,32.8 0 top
PAD3  25.44,30.26 0 top
PAD4  17.78,22.64 0 top
PAD5  15.24,25.18 0 top
PAD6  15.24,22.64 0 top
PAD7  17.78,27.72 0 top
PAD8  17.78,25.18 0 top
PAD9  20.32,25.18 0 top
PAD10  22.86,32.8 0 top
PAD11  20.32,30.26 0 top
PAD12  22.86,30.26 0 top
PAD13  15.24,27.74 0 top
PAD14  12.7,27.72 0 top
PAD15  12.7,25.18 0 top
PAD16  15.24,30.26 0 top
PAD17  17.78,30.26 0 top
PAD18  15.24,32.8 0 top
PAD19  1.8,40.4 0 top
Q1  30.64,24.09 90 top
Q2  30.82,30.58 0 top
Q3  50.83,52.66 90 bottom
Q4  14.98,52.58 90 bottom
Q5  72.24,52.97 0 bottom
Q6  33.16,52.67 90 bottom
Q7  5.83,43.6 270 top
Q8  3.3,38.08 0 top
Q9  9.26,9.6 0 bottom
Q10  38.99,8.4 270 top
Q11  13.35,8.71 270 bottom
Q12  33.3,8.54 270 top
R1  2.84,22.73 90 top
R2  7.02,23.89 180 bottom
R3  25.76,10.56 90 bottom
R4  28.46,10.54 90 bottom
R5  7,21.19 180 bottom
R6  72.39,45.5 90 bottom
R7  69.85,45.5 90 bottom
R8  67.31,45.5 90 bottom
R9  64.77,45.5 90 bottom
R10  59.69,45.5 90 bottom
R11  62.23,45.5 90 bottom
R12  57.15,45.5 90 bottom
R13  54.61,45.5 90 bottom
R14  52.07,45.5 90 bottom
R15  49.53,45.5 90 bottom
R16  46.99,45.5 90 bottom
R17  41.91,45.5 90 bottom
R18  44.45,45.5 90 bottom
R19  39.37,45.5 90 bottom
R20  36.83,45.5 90 bottom
R21  34.29,45.5 90 bottom
R22  31.75,45.5 90 bottom
R23  29.21,45.5 90 bottom
R24  24.13,45.5 90 bottom
R25  26.67,45.5 90 bottom
R26  21.59,45.5 90 bottom
R27  19.05,45.5 90 bottom
R28  16.51,45.5 90 bottom
R29  13.97,45.5 90 bottom
R30  11.43,45.5 90 bottom
R31  6.35,45.5 90 bottom
R32  8.89,45.5 90 bottom
R33  3.81,45.5 90 bottom
R34  3.23,32.16 90 bottom
R35  12.79,34.83 90 top
R36  11.03,38.59 90 bottom
R37  10.82,30.59 90 bottom
R38  15.97,39.37 0 bottom
R39  55.28,20.63 0 top
R40  6.19,8.03 270 bottom
R41  43.29,8.33 180 top
R42  11.71,13.75 180 bottom
R43  7,13.82 0 bottom
R44  11.77,16.63 0 bottom
R45  7.03,16.71 180 bottom
R46  9.68,10.02 0 top
SV1  27.2,4.81 90 top
SV2  37.9,11.95 180 top
SV3  48.45,10.04 270 top
SV4  72.99,28.87 270 top
SV5  37.37,3.95 180 top
SV8  22.86,27.6 180 top
SV9  17.9,36.5 0 top
T1  2.84,17.33 0 top
U$2  59.97,7.88 90 top
U$3  10.01,16.3 0 top
XDATA  22.4,13.5 0 top
XGND1  20.32,27.72 0 top
XGND2  25.44,35.24 0 top
XGND3  22.86,35.25 0 top
XGND4  20.28,22.64 0 top
XGND5  22.7,24 0 top
XGND8  21,11.1 0 top
XRESET  25.3,13.7 0 top
XVCC1  27.9,35.2 0 top
XVCC2  27.94,32.8 0 top
XVCC3  12.7,22.64 0 top
XVCC4  19.7,16.3 0 top

### Tracks (layer width: path | path; a pad name or v marks a point on that pad's centre or on a via)
GND  (via drill 0.5, 0.6)
  Top 0.3: IC3.3 38.18,22.27 v37.95,22.5
  Bottom 0.3: v37.95,22.5 37.8,22.65 37.8,23.88 C16.2
  other vias: 53.1,18.75 42.9,22.5 47.1,22.35 48.6,31.2 44.1,34.5 41.1,34.5 36.75,28.35 40.05,28.5 37.2,33.5 36,36.1 69.8,54.5 45.1,52.5 20.6,51.3 17.3,13.4 67.5,38.1
  pour Top (isolate 0.22): 0,0 0,60 75,60 75,0
  pour Bottom (isolate 0.25): 0,60 75,60 0,0
N$1  (via drill 0.5)
  Top 0.3: v58.8,6.75 55.64,6.75 U$2.12 | IC3.20 46.68,18.87 48.75,16.8 v49.05,16.8
  Bottom 0.3: v58.8,6.75 59.4,7.35 59.4,10.5 53.1,16.8 v49.05,16.8
N$2  (via drill 0.5)
  Top 0.3: IC3.21 47.18,19.27 48.75,17.7 v50.55,17.7 | v59.85,12.15 69.15,2.85 69.1,2.85 U$2.1
  Bottom 0.3: v50.55,17.7 53.1,17.7 58.65,12.15 v59.85,12.15
N$3
  Top 0.3: IC3.22 47.68,19.52 48.6,18.6 51.15,18.6 51.9,17.85 51.9,5.4 52.5,4.8 53.6,4.8 U$2.13
N$4
  Top 0.3: U$2.14 52.5,3 51.15,4.35 51.15,15.45 50.7,15.9 48.3,15.9 48,16.2 48,16.65 46.18,18.47 IC3.19
N$5  (via drill 0.5)
  Top 0.3: v58.2,8.85 55.74,8.85 U$2.11 | IC3.18 45.68,18.07 47.4,16.35 47.4,15.6 48,15 v49.05,15
  Bottom 0.3: v49.05,15 52,15 58.2,8.8 v58.2,8.85
N$6  (via drill 0.5)
  Top 0.3: v59.85,19.95 v62.25,19.95 | IC3.16 44.68,17.87 44.55,17.7 44.55,15.45 44.7,15.3 v46.5,15.3
  Bottom 0.3: v62.25,19.95 63.3,19.95 70.53,12.72 C1.1 | IR1.VS 72.48,5.79 C1.1 | C1.1 70.8,6.06 | v59.85,19.95 50.3,19.95 46.5,16.15 v46.5,15.3
N$7
  Top 0.3: PAD1.1 55.63,14.74 U$2.8
N$8  (via drill 0.5)
  Top 0.3: v59.85,21.45 v62.25,21.45 | IC3.17 45.18,16.92 arc90 v45.45,16.8
  Bottom 0.3: v59.85,21.45 50.95,21.45 49.4,19.9 48.15,19.9 45.45,17.2 v45.45,16.8 | IR1.VO 63.12,21.45 v62.25,21.45
N$9
  Bottom 0.3: R3.1 25.95,9.77 25.95,9.9 27.15,8.7 27.15,3.59 SV1.1
N$10  (via drill 0.5)
  Top 0.3: IC3.89 31.79,27.89 30.7,28.35 29.4,28.35 28.2,27.15 v28.2,22.5
  Bottom 0.2: XDATA.1 22.35,13.5
  Bottom 0.3: R3.2 24.34,11.51 22.35,13.5 22.35,16.65 v28.2,22.5
N$11  (via drill 0.5)
  Top 0.3: IC3.87 32.14,28.89 30.8,29.55 28.95,29.55 27.1,27.7 27.1,25.9 26.1,24.9 26.1,23.2 25.1,22.2 22.05,22.2 20.7,20.85 18.45,20.85 v17.7,20.1
  Bottom 0.3: R2.2 R5.2 8.55,21.15 9.6,20.1 v17.7,20.1
N$12
  Top 0.3: IC3.91 31.2,26.89 Q1.2
  Bottom 0.3: C4.1 30.83,26.82 Q1.2
N$13
  Top 0.3: IC3.92 32.39,26.39 30.9,24.9 30.9,21.74 Q1.1
  Bottom 0.3: C5.1 31.99,22.9 Q1.1
N$14
  Top 0.3: 30.3,36.1 28.45,37.95 24.9,37.95 23.85,39 19.75,39 19.15,39.6 16.65,39.6 15.9,40.35 13.5,40.35 12.45,41.4 6.9,41.4 5.9,42.4 5.9,43.1 5.4,43.6 5.4,43.98 Q7.1 | 30.3,36.1 30.2,36.1 | 30.3,36.1 30.3,35 32.21,33.19 33.11,33.19 33.4,32.9 IC3.79
N$15
  Top 0.3: IC3.35 52.84,26.89 55.8,29.85 55.8,32.25 58.35,34.8 63.02,34.8 IC1.5
N$16
  Top 0.3: IC3.36 52.59,27.39 55.35,30.15 55.35,32.7 58.05,35.4 61.8,35.4 63.15,36.75 63.15,37.02 IC1.6
N$17  (via drill 0.5)
  Top 0.3: IC3.5 39.18,19.23 37.8,17.85 v37.8,16.8 | v28.5,19.35 27.3,19.35 26.4,18.45 17.4,18.45 16.2,19.65 v16.2,21.15
  Bottom 0.3: 37.8,16.65 v37.8,16.8 37.8,18.75 37.05,19.5 28.7,19.5 v28.5,19.35 | v16.2,21.15 10.8,21.15 9.6,22.35 9.6,24.75 9,25.35 6.9,25.35 6.15,24.6 R2.1 5.69,23.89 3.8,22 3.28,21.5 R1.1
N$18  (via drill 0.5)
  Top 0.3: IC3.90 31.41,27.39 30.55,27.75 29.7,27.75 29.4,27.45 v29.4,23.85
  Bottom 0.3: SV5.6 36.77,2.68 35.4,4.05 33.9,4.05 33.6,4.35 33.6,7.35 29.4,11.55 28.42,11.55 | 28.42,11.55 R4.2 | 28.42,11.55 28.42,12.18 26.85,13.75 25.22,13.75 25.22,13.78 | v29.4,23.85 29.4,21.6 28.8,21 27.6,21 25.22,18.62 25.22,13.78 | XRESET.1 25.22,13.78
N$19
  Bottom 0.3: SV1.5 R4.1
N$20
  Top 0.3: Q2.2 32.3,30.4 32.81,29.89 IC3.85
  Bottom 0.3: 32.79,32.23 C11.1 32.09,32.12 Q2.2
N$21
  Top 0.3: IC3.86 32.29,29.39 30,30.5 Q2.1
  Bottom 0.3: Q2.1 29.55,32.24 C10.1
N$22
  Top 0.2: SV2.6 31.8,12.2 31.8,13.05 32.85,14.1 32.85,22.95 33.75,23.85 35.14,23.85 IC3.97
N$23
  Top 0.2: SV2.5 34.09,14.36 33.45,15 33.45,22.95 33.9,23.4 IC3.98
N$24
  Top 0.2: SV2.4 36.6,11.98 36.6,13.2 36.3,13.5 35.85,13.5 34.05,15.3 34.05,22.65 34.35,22.95 35.12,22.95 IC3.99
N$25
  Top 0.2: SV2.3 39.15,11.97 39.15,13.35 38.55,13.95 36.15,13.95 34.65,15.45 34.65,22.31 IC3.100
N$26
  Top 0.2: SV2.2 41.7,13.35 40.5,14.55 36.45,14.55 35.25,15.75 35.25,19.05 35.7,19.5 37.2,19.5 37.2,20.37 IC3.1
N$27  (via drill 0.5)
  Top 0.3: IC3.96 33.24,24.39 32.25,23.4 32.25,20.55 31.5,19.95 30,19.95 29.25,20.25 24.45,20.25 24.15,19.95 19.65,19.95 v19.2,19.5
  Bottom 0.3: v19.2,19.5 18.75,19.05 7.8,19.05 6.05,20.8 6.05,21.15 | T1.C 4.3,17.52 4.3,19.4 6.05,21.15 | 6.05,21.15 R5.1
N$28
  Top 0.3: Q7.3 6.83,45.34 7.51,46.02
  Top 0.4: 22.86,48.04 20.84,46.02 7.51,46.02
  Top 0.406: LED1.1 55.13,46.02 42.66,46.02 40.64,48.04 | 40.64,48.04 LED2.1 | 40.64,48.04 38.47,45.87 25.03,45.87 22.86,48.04 LED3.1 | 7.51,46.02 7.1,46.02 5.08,48.04 LED4.1
N$29  (via drill 0.5)
  Top 0.3: v40.35,16.8 40.35,18.15 41.18,18.98 IC3.9
  Bottom 0.3: v40.35,16.8 40.05,16.5 40.05,16.2 37.95,14.1 37.95,5.8 SV5.5
N$30
  Top 0.3: SV5.9 33.6,3.9 43.2,3.9 44.85,5.55 49.35,5.55 50.55,6.75 50.55,13.5 50.1,13.95 46.2,13.95 45.45,14.7 42.75,14.7 41.25,16.2 41.25,18.15 41.68,18.73 IC3.10
N$31  (via drill 0.5)
  Top 0.3: v42.15,16.8 42.18,17.73 IC3.11
  Bottom 0.3: v42.15,16.8 42.15,14.85 40.5,13.2 40.5,9.45 38.7,7.65 38.7,4.35 39.15,3.9 41.1,3.9 41.4,4.2 41.55,4.32 SV5.1
N$32  (via drill 0.5)
  Top 0.3: IC3.12 42.68,17.77 v43.65,16.8
  Bottom 0.3: v43.65,16.8 43.65,13.95 43.05,13.35 43.05,9.45 39.9,6.3 SV5.3
N$33  (via drill 0.5)
  Top 0.3: LED4.3 10.16,47.89 11.4,46.65 20.4,46.65 21.6,47.85 21.6,50.85 22.05,51.3 27,51.3 27.9,50.4 27.9,49.35 LED3.3 28.05,49.2 28.05,48 29.25,46.8 38.1,46.8 39.15,47.85 39.15,50.7 | 39.15,50.7 39.9,51.45 44.85,51.45 45.72,50.52 LED2.3 45.72,48.18 47.1,46.8 54.75,46.8 57.15,49.2 57.15,50.55 58,51.4 63.05,51.4 63.45,51 63.45,49.36 LED1.3 | v37.35,51.3 38.55,51.3 39.15,50.7
  Bottom 0.3: Q6.3 35.98,52.67 v37.35,51.3
N$34
  Bottom 0.3: Q5.3 72.24,54.39 73.2,55.35 73.2,58.8 72.75,59.25 64.55,59.25 64.47,59.17
  Bottom 0.406: LED4.10 10.16,58.2 11.13,59.17 26.97,59.17 27.94,58.2 | 27.94,58.2 LED3.10 | 45.72,58.2 LED2.10 | 45.72,58.2 44.75,59.17 28.91,59.17 27.94,58.2 | 63.5,58.2 62.53,59.17 46.69,59.17 45.72,58.2 | 63.5,58.2 LED1.10 | 63.5,58.2 64.47,59.17
N$35  (via drill 0.5)
  Top 0.3: LED4.7 17.78,57.82 16.35,59.25 14.7,59.25 13.95,58.5 v13.95,54.91
  Top 0.4: 18,57.9 19.27,59.17 34.59,59.17
  Top 0.406: LED1.7 71.12,58.2 70.15,59.17 54.31,59.17 53.34,58.2 | 53.34,58.2 LED2.7 | 53.34,58.2 52.37,59.17 36.53,59.17 35.56,58.2 | LED4.7 17.78,57.68 18,57.9 | 35.56,58.2 LED3.7 | 34.59,59.17 35.56,58.2
  Bottom 0.3: v13.95,54.91 14.54,54.91 15.9,53.55 15.9,52.66 Q4.3
N$36  (via drill 0.5)
  Top 0.3: 52.07,54.39 v52.07,54.58 v52.06,54.59 | 33.02,55.66 33.02,55.63 34.35,54.3 49.44,54.3 50.8,55.66
  Top 0.406: LED1.8 68.58,55.66 67.31,54.39 52.07,54.39 50.8,55.66 LED2.8 | LED3.8 33.02,55.66 32.05,54.69 16.06,54.69 15.24,55.66 LED4.8
  Bottom 0.3: Q3.3 51.83,54.36 v52.06,54.59
N$37
  Bottom 0.406: R6.2 72.39,48.04 LED1.6
N$38
  Bottom 0.406: R7.2 69.85,48.04 LED1.5
N$39
  Bottom 0.406: R8.2 67.31,48.04 LED1.4
N$40
  Bottom 0.406: R9.2 64.77,55.66 LED1.9
N$41
  Bottom 0.3: R11.2 62.23,47.37 61,48.6 61,49.27 LED1.2
N$42
  Bottom 0.406: R10.2 59.69,54.76 60.9,55.95 60.9,56.87 LED1.11
N$43
  Bottom 0.406: R12.2 57.15,55.66 LED1.12
N$44  (via drill 0.6)
  Top 0.3: IC3.50 51.79,34.39 53.7,36.3 53.7,39.75 55.95,42 58.65,42 v59.55,42.9
  Bottom 0.3: v59.55,42.9 59.55,44.41 R10.1
N$45  (via drill 0.6)
  Top 0.3: IC3.48 52.29,33.39 54.6,35.7 54.6,39.15 56.55,41.1 62.85,41.1 v64.65,42.9
  Bottom 0.3: v64.65,42.9 64.65,44.43 R9.1
N$46  (via drill 0.6)
  Top 0.3: IC3.46 52.79,32.39 55.5,35.1 55.5,38.55 57.15,40.2 67.05,40.2 v69.75,42.9
  Bottom 0.3: v69.75,42.9 69.75,44.45 R7.1
N$47  (via drill 0.6)
  Top 0.3: IC3.45 53.04,31.89 56.1,34.95 56.1,38.25 57.6,39.75 67.35,39.75 69.45,41.85 71.25,41.85 v72.3,42.9
  Bottom 0.3: v72.3,42.9 72.3,44.46 R6.1
N$48  (via drill 0.6)
  Top 0.3: IC3.47 52.54,32.89 55.05,35.4 55.05,38.85 56.85,40.65 64.95,40.65 v67.2,42.9
  Bottom 0.3: v67.2,42.9 67.2,44.44 R8.1
N$49  (via drill 0.6)
  Top 0.3: IC3.49 52.04,33.89 54.15,36 54.15,39.45 56.25,41.55 60.75,41.55 v62.1,42.9
  Bottom 0.3: v62.1,42.9 62.1,44.42 R11.1
N$50  (via drill 0.6)
  Top 0.3: IC3.51 49.18,40.33 49.5,40.65 53.85,40.65 56.1,42.9 v57,42.9
  Bottom 0.3: v57,42.9 57,44.4 R12.1
N$51
  Bottom 0.406: R13.2 54.61,48.04 LED2.6
N$52
  Bottom 0.406: R14.2 52.07,48.04 LED2.5
N$53
  Bottom 0.406: R15.2 49.53,48.04 LED2.4
N$54
  Bottom 0.406: R16.2 46.99,55.66 LED2.9
N$55
  Bottom 0.3: R18.2 44.45,46.95 43.18,48.22 LED2.2
N$56
  Bottom 0.406: R17.2 41.91,54.76 43.2,56.05 43.2,56.1 LED2.11
N$57
  Bottom 0.406: R19.2 39.37,55.66 LED2.12
N$58  (via drill 0.6)
  Top 0.3: IC3.59 45.18,39.72 v42,42.9
  Bottom 0.3: v42,42.9 42,44.46 R17.1
N$59  (via drill 0.6)
  Top 0.3: IC3.57 46.18,42.13 v46.95,42.9
  Bottom 0.3: v46.95,42.9 46.95,44.51 R16.1
N$60  (via drill 0.6)
  Top 0.3: IC3.55 47.18,39.83 48.9,41.55 50.7,41.55 v52.05,42.9
  Bottom 0.3: v52.05,42.9 52.05,44.53 R14.1
N$61  (via drill 0.6)
  Top 0.3: IC3.52 48.68,40.58 49.2,41.1 52.05,41.1 53.85,42.9 v54.45,42.9
  Bottom 0.3: v54.45,42.9 54.45,44.39 R13.1
N$62  (via drill 0.6)
  Top 0.3: IC3.56 46.68,40.08 v49.5,42.9
  Bottom 0.3: v49.5,42.9 49.5,44.52 R15.1
N$63  (via drill 0.6)
  Top 0.3: IC3.58 45.68,41.77 v44.55,42.9
  Bottom 0.3: v44.55,42.9 44.55,44.45 R18.1
N$64  (via drill 0.6)
  Top 0.3: IC3.60 44.68,39.32 42,42 40.35,42 v39.45,42.9
  Bottom 0.3: v39.45,42.9 39.45,44.47 R19.1
N$65
  Top 0.4: J2.2 6.31,4.64 2.1,8.85 2.1,9.98 R46.1 | R46.1 2.18,9.9 | U$3.P$1 6.86,14.82 R46.1
  Bottom 0.4: R46.1 2.09,10.05 3.45,10.05 6,12.6 6,13.77 R43.2
N$66
  Bottom 0.406: R20.2 36.83,48.04 LED3.6
N$67
  Bottom 0.406: R21.2 34.29,48.04 LED3.5
N$68
  Bottom 0.406: R22.2 31.75,48.04 LED3.4
N$69
  Bottom 0.406: R23.2 29.21,55.66 LED3.9
N$70
  Bottom 0.3: R25.2 26.67,47.33 25.4,48.6 LED3.2
N$71
  Bottom 0.406: R24.2 24.13,54.76 25.35,55.95 25.35,56.88 LED3.11
N$72
  Bottom 0.406: R26.2 21.59,55.66 LED3.12
N$73  (via drill 0.6)
  Top 0.3: IC3.68 40.68,38.52 39.9,39.3 34.05,39.3 32.25,41.1 27,41.1 25.95,42.15 24.9,42.15 v24.15,42.9
  Bottom 0.3: v24.15,42.9 24.15,44.53 R24.1
N$74  (via drill 0.6)
  Top 0.3: IC3.66 41.68,39.32 40.8,40.2 34.65,40.2 32.85,42 30.15,42 v29.25,42.9
  Bottom 0.3: v29.25,42.9 29.25,44.51 R23.1
N$75  (via drill 0.6)
  Top 0.3: IC3.62 43.68,38.82 41.4,41.1 36.15,41.1 v34.35,42.9
  Bottom 0.3: v34.35,42.9 34.35,44.49 R21.1
N$76  (via drill 0.6)
  Top 0.3: IC3.61 44.18,39.07 41.7,41.55 38.25,41.55 v36.9,42.9
  Bottom 0.3: v36.9,42.9 36.9,44.48 R20.1
N$77  (via drill 0.6)
  Top 0.3: IC3.65 42.18,39.57 41.1,40.65 34.95,40.65 32.7,42.9 v31.8,42.9
  Bottom 0.3: v31.8,42.9 31.8,44.5 R22.1
N$78  (via drill 0.6)
  Top 0.3: IC3.67 41.18,38.92 40.35,39.75 34.35,39.75 32.55,41.55 28.2,41.55 v26.85,42.9
  Bottom 0.3: v26.85,42.9 R25.1
N$79  (via drill 0.6)
  Top 0.3: IC3.69 40.18,38.23 39.6,38.85 33.75,38.85 31.95,40.65 26.7,40.65 25.65,41.7 24.6,41.7 24.45,41.85 22.65,41.85 v21.6,42.9
  Bottom 0.3: v21.6,42.9 R26.1
N$80
  Bottom 0.406: R27.2 19.05,48.04 LED4.6
N$81
  Bottom 0.406: R28.2 16.51,48.04 LED4.5
N$82
  Bottom 0.406: R29.2 13.97,48.04 LED4.4
N$83
  Bottom 0.406: R30.2 11.43,55.66 LED4.9
N$84
  Bottom 0.406: R32.2 8.89,48.04 LED4.2
N$85
  Bottom 0.406: R31.2 6.35,54.61 7.65,55.95 7.65,56.9 LED4.11
N$86
  Bottom 0.406: R33.2 3.81,55.66 LED4.12
N$87  (via drill 0.5)
  Top 0.3: v34.4,36.05 34.4,36 35.3,35.1 36.3,35.1 36.45,34.95 36.45,34.2 36.15,33.9 IC3.77
  Bottom 0.3: R31.1 6.35,43.75 8.65,41.45 32.25,41.45 34.4,39.4 v34.4,36.05
N$88  (via drill 0.6)
  Top 0.3: v11.55,42.85 12.5,42.85 13.95,41.4 16.5,41.4 17.25,40.65 19.75,40.65 20.5,39.9 24.45,39.9 25.5,38.85 30.75,38.85 32.55,37.05 37.18,37.05 IC3.75
  Bottom 0.3: R30.1 11.43,42.97 v11.55,42.85
N$89  (via drill 0.6)
  Top 0.3: IC3.71 39.18,37.62 38.85,37.95 33.15,37.95 31.35,39.75 26.1,39.75 25.05,40.8 21.3,40.8 20.25,41.85 17.7,41.85 v16.65,42.9
  Bottom 0.3: v16.65,42.9 16.65,44.41 R28.1
N$90  (via drill 0.6)
  Top 0.3: IC3.70 39.68,38.02 39.3,38.4 33.45,38.4 31.65,40.2 26.4,40.2 25.35,41.25 21.7,41.25 20.05,42.9 v19.2,42.9
  Bottom 0.3: v19.2,42.9 19.2,44.4 R27.1
N$91  (via drill 0.6)
  Top 0.3: IC3.72 38.68,37.37 38.55,37.5 32.85,37.5 31.05,39.3 25.8,39.3 24.75,40.35 20.9,40.35 20,41.25 17.4,41.25 16.65,42 15,42 v14.1,42.9
  Bottom 0.3: v14.1,42.9 14.1,44.42 R29.1
N$92  (via drill 0.6)
  Top 0.3: IC3.76 34.43,34.42 30.45,38.4 25.2,38.4 24.15,39.45 20.15,39.45 19.55,40.05 16.95,40.05 16.2,40.8 13.8,40.8 12.75,41.85 9.75,41.85 9,42.6 v9,42.85
  Bottom 0.3: v9,42.85 8.89,42.86 R32.1
N$93  (via drill 0.5)
  Top 0.3: v31.3,36.1 33.99,33.39 IC3.78
  Bottom 0.3: R33.1 3.81,44.49 7.5,40.8 29.1,40.8 31.35,38.55 31.3,36.2 v31.3,36.1
N$94
  Bottom 0.4: J1.2 17.04,6.41 D4.A
N$95  (via drill 0.5)
  Top 0.3: IC3.80 33.21,32.39 32.9,32.7 32.01,32.69 29.8,34.8 29.8,35.8 29.7,35.9 28.15,37.5 24.6,37.5 23.55,38.55 19.35,38.55 18.75,39.15 16.35,39.15 15.6,39.9 13.2,39.9 12.45,40.65 4.65,40.65 3.6,41.7 3.6,51 4.2,51.6 14.2,51.6 15,52.4 27.4,52.4 27.9,51.9 v30.75,51.9
  Bottom 0.3: Q6.1 30.93,51.72 v30.75,51.9
N$96  (via drill 0.5)
  Top 0.3: 47.7,53.43 v48.27,53.43 | v67.35,52.95 67.2,52.95 66.75,53.4 47.73,53.4 47.7,53.43 | 47.7,53.43 30.87,53.43 v30.75,53.55 30.63,53.43 13.62,53.43 13.02,54.03 v12.57,54.03 12.3,54 4.5,54 0.9,50.4 0.9,41.3 PAD19.1 3.05,39.15 3.37,39.15 | Q7.2 4.83,41.97 v5.25,41.55 | 3.37,39.15 v4.65,39.15 | 3.37,39.15 Q8.3
  Bottom 0.3: Q5.2 70.31,52.95 v67.35,52.95 | v30.75,53.55 32.09,53.55 Q6.2 | 5.25,39.75 v5.25,41.55 | v4.65,39.15 5.25,39.75 | 5.25,39.75 5.46,39.54 R36.2 14.6,39.54 R38.2 | Q4.2 13.07,53.53 v12.57,54.03 | Q3.2 48.45,53.61 v48.27,53.43
  Bottom 0.4: C20.1 3.83,39.15 v4.65,39.15
N$97  (via drill 0.5)
  Top 0.3: v37.2,31.95 37.14,31.89 IC3.81
  Bottom 0.3: Q5.1 73.19,48.91 73.8,48.3 73.8,42.6 73.05,41.85 68.95,41.85 68.6,41.5 54.6,41.5 53.3,40.2 53.3,37.4 52.1,36.2 39.6,36.2 38.6,35.2 38.6,32.55 38.5,32.45 37.8,31.95 v37.2,31.95
N$98  (via drill 0.5)
  Top 0.3: v12.63,52.53 10.2,52.5 4.05,52.5 1.5,49.95 1.5,43.05 4.5,40.05 12.3,40.05 12.9,39.45 15.3,39.45 16.2,38.55 18.5,38.55 18.95,38.1 23.25,38.1 24.3,37.05 27.85,37.05 29.3,35.6 29.3,34.6 31.71,32.19 32.71,32.19 33.5,31.4 IC3.82
  Bottom 0.3: Q4.1 13.53,51.63 v12.63,52.53
N$99  (via drill 0.5)
  Top 0.3: IC3.41 52.09,29.89 52.5,30.3 52.5,30.9 52.8,31.2 53.1,31.2 57.75,35.85 58.8,35.85 59.4,36.45 59.4,38.55 60.15,39.3 67.8,39.3 69.75,41.25 71.55,41.25 72.15,41.85 72.9,41.85 73.8,42.75 73.8,49.8 72.2,51.4 64.95,51.4 64,52.35 55.95,52.35 55.45,51.85 v54.85,51.85
  Bottom 0.3: v54.85,51.85 52.9,51.85 52.35,51.3 50.24,51.3 Q3.1
N$100
  Top 0.3: Q8.1 2.35,35.75 C18.1 3.56,34.89
  Top 0.4: IC2.1 5.7,32.9 3.71,34.89 C18.1
N$101  (via drill 0.5)
  Top 0.3: IC2.4 7.84,35.21 7.65,35.55 v7.65,36.45
  Bottom 0.3: v7.65,36.45 7.65,33.15 5.85,31.35 5.84,30.15 D5.2 5.92,30.05
  Bottom 0.4: 5.92,30.05 4.39,30.05 R34.1
N$102
  Bottom 0.3: R36.1 12.42,37.64 R35.E
N$103
  Bottom 0.3: R35.A 11.53,32.29 R37.2
N$104  (via drill 0.5)
  Top 0.3: P1.2 62.58,23.97 v58.5,24 58.5,22.9 R39.2 | v41.4,22.5 40.95,22.5 39.9,21.45 39.75,21.45 39.68,21.38 IC3.6
  Bottom 0.3: v58.5,24 52.2,24 49.1,20.85 42.9,20.85 v41.4,22.5
N$105  (via drill 0.5)
  Top 0.3: v7.65,31.2 IC2.3
  Bottom 0.3: R35.S 10.25,33.8 v7.65,31.2
N$106  (via drill 0.6)
  Top 0.3: IC3.40 52.79,29.39 v53.55,30.15
  Bottom 0.3: v53.55,30.15 55.5,30.15 57.55,28.1 63.47,28.1 P1.1
N$107
  Top 0.3: SV4.9 72.07,20.03 68.85,23.25 65.1,23.25 63.3,25.05 58.05,25.05 54.9,21.9 50.69,21.9 IC3.25
N$108
  Top 0.3: IC3.26 54.49,22.39 57.9,25.65 63.45,25.65 65.3,23.8 70.3,23.8 71.58,22.52 SV4.8
N$109
  Top 0.3: IC3.27 53.94,22.89 57.45,26.4 63.6,26.4 65.1,24.9 70.8,24.9 70.96,25.06 SV4.7
N$110
  Top 0.3: IC3.28 53.54,23.39 57.15,27 71.4,27 71.9,27.5 SV4.6
N$111
  Top 0.3: IC3.29 53.14,23.89 56.85,27.6 66.9,27.6 69.3,30 72.73,30 SV4.5
N$112
  Top 0.3: IC3.30 52.74,24.39 56.55,28.2 66.3,28.2 68.85,30.75 70.91,30.75 SV4.4
N$113
  Top 0.3: IC3.31 52.49,24.89 57,29.4 57,31.95 58.8,33.75 66.3,33.75 66.75,34.2 67.72,35.2 67.92,35.4 71.1,35.4 71.28,35.22 SV4.3
N$114
  Top 0.3: IC3.32 52.09,25.39 56.4,29.7 56.4,32.1 58.65,34.35 65.7,34.35 68.25,36.9 69.13,37.75 SV4.2
N$115
  Bottom 0.4: D4.C 8.95,7.05 8.4,7.05 | R40.2 6.22,7.05 8.4,7.05 | Q9.2 8.4,8.51 8.4,7.05
N$116
  Bottom 0.3: R40.1 6.9,9.6 9.2,9.6 Q9.1 10.25,8.7 Q11.3
N$117
  Bottom 0.3: 17.27,10.05 17.25,10.8 14.4,13.65 13.21,13.65 R42.2 12.81,13.41 11.4,12 9.75,12 9.3,11.55 9.3,10.64 Q9.3
  Bottom 0.4: 17.27,10.05 R46.2
N$118  (via drill 0.5)
  Top 0.3: IC3.2 37.68,19.23 37.05,18.6 v36.3,18.6 | v16.05,18 27.3,18 27.75,18.45 v30.45,18.45
  Bottom 0.3: R43.1 7.95,16.68 R45.2 7.95,17.7 8.7,18.45 15.65,18.45 v16.05,18 | v36.3,18.6 36.15,18.45 v30.45,18.45
N$119  (via drill 0.5)
  Top 0.3: IC3.95 32.84,24.89 31.8,23.7 31.8,20.85 31.35,20.55 30.15,20.55 28.95,21.15 v22.65,21.15
  Bottom 0.3: R42.1 10.76,16.57 R44.2 10.8,17.55 11.1,17.85 14.55,17.85 15.75,16.65 18,16.65 22.35,21 22.45,21.05 v22.65,21.15
N$120  (via drill 0.5)
  Top 0.3: IC3.37 49.64,27.89 v49.05,27.3
  Bottom 0.3: J4.2 50.16,3.45 60.3,3.45 61.35,4.5 61.35,13.05 60.75,13.65 60.75,25.35 59.4,26.7 55.3,26.7 54.7,27.3 v49.05,27.3
N$121  (via drill 0.5)
  Top 0.3: IC3.38 49.01,28.39 v48.6,28.8
  Bottom 0.3: v48.6,28.8 48.85,28.55 54.85,28.55 56.1,27.3 59.55,27.3 61.35,25.5 61.35,13.8 61.95,13.2 61.95,4.35 58.8,1.2 48,1.2 46.35,2.85 J4.1
N$122  (via drill 0.5)
  Top 0.3: IC3.42 47.91,30.39 47.55,30.75 47.55,32.41 49.65,34.5 49.65,34.65 51.9,36.9 v51.9,39.6
  Bottom 0.3: v51.9,39.6 41.3,39.6 36.9,35.2 35.7,35.2 34.8,34.3 34.8,29.7 34.1,29 29.2,29 27.8,30.44 PAD2.1
N$123  (via drill 0.5)
  Top 0.3: IC3.88 31.94,28.39 30.8,28.95 29.1,28.95 27.6,27.4 27.6,25.35 27,24.75 v27,23.85
  Bottom 0.3: v27,23.85 27,23.15 21.15,17.3 21.15,15.75 19.35,13.95 19.35,9.6 18.1,8.35 16.3,8.35 Q11.1
N$124
  Top 0.3: Q10.3 34.84,8.4 Q12.3 29.41,8.54 29.1,8.85 21.76,8.85 C22.2
N$125  (via drill 0.5)
  Top 0.3: IC3.15 44.18,19.13 v43.65,18.6 | Q12.1 32.91,9.9 v35.4,9.9 37.44,9.9 Q10.1 38.55,9.9 40.77,9.9 R41.2
  Bottom 0.3: v43.65,18.6 40.05,18.6 39.3,17.85 39.3,16.5 36.9,14.1 36,14.1 35.4,13.5 v35.4,9.9
N$126
  Top 0.4: J3.2 21.53,4.94 C22.1
N$127  (via drill 0.5)
  Top 0.3: IC3.39 50.01,28.89 49.05,29.85 47.7,29.85 46.95,30.45 46.95,32.55 49.05,34.65 49.05,34.8 49.95,35.7 50.55,36.33 50.6,36.38 v50.6,38
  Bottom 0.3: v50.6,38 50.5,37.9 40.4,37.9 37.1,34.6 36,34.6 35.5,34.1 35.5,29.5 34.4,28.4 27.3,28.4 PAD3.1
N$128
  Top 0.3: IC3.7 40.18,19.48 38.7,18 38.7,15.6 39.3,15 40.95,15 42.15,13.8 44.7,13.8 45.6,12.9 45.6,10.35 SV3.3
N$129
  Top 0.3: IC3.8 40.68,19.23 39.3,17.85 39.3,15.9 39.75,15.45 41.25,15.45 42.45,14.25 45,14.25 46.05,13.2 46.05,11.69 47.1,10.64 47.7,10.05 48.16,10.04 SV3.2
N$131
  Top 0.406: XGND5.1 22.86,24 SV8.2
N$132  (via drill 0.5)
  Top 0.3: C19.1 6.27,37.27 v5.7,36.7 5.7,35.17 IC2.5
  Top 0.4: SV9.1 13.96,35.1 12.4,35.1 10.1,37.4 v9.6,37.4
  Bottom 0.3: R34.2 5.7,35.58 v5.7,36.7
  Bottom 0.4: v9.6,37.4 6.4,37.4 v5.7,36.7
N$156
  Bottom 0.6: PAD5.1 PAD6.1 PAD4.1
N$157
  Bottom 0.6: PAD9.1 PAD8.1 PAD7.1
N$158
  Bottom 0.6: PAD11.1 PAD12.1 PAD10.1
N$159
  Bottom 0.6: PAD15.1 PAD14.1 12.72,27.74 PAD13.1
N$160
  Bottom 0.6: PAD17.1 PAD16.1 PAD18.1
VCC  (via drill 0.5)
  Top 0.3: IC3.14 43.68,21.78 v44.4,22.5 | IC3.24 48.68,22.27 v48.6,22.35 | IC3.34 49.21,26.39 v48.75,25.8 | IC3.44 49.84,31.39 v49.35,32.7 | v46.35,34.5 46.8,34.5 47.68,35.38 IC3.54 | IC3.74 37.68,34.92 38.1,34.5 v39.6,34.5 | IC3.64 42.68,34.58 v42.6,34.5 | v38.55,30.9 v38.54,30.89 IC3.83 33.26,30.89 32.5,31.65 29.09,31.65 XVCC2.1 | SV4.10 71.76,17.44 66.95,22.35 60.45,22.35 v59.85,22.95 59.7,22.65 59.25,22.65 58.8,22.2 58.8,18.68 C3.1 59.1,18.26 58.8,18.26 58.8,13.95 57.73,12.88 U$2.9 | 4.25,36.82 Q8.2 | SV1.2 27,3.3 27.15,3.45 29.4,3.45 30.6,4.65 30.6,5.7 31.35,6.45 34.95,6.45 v36,7.5 37.94,7.5 Q10.2 | v39.45,22.5 38.68,21.73 IC3.4 38.68,19.48 v36.3,17.1 | v39,25.65 36.75,25.65 36.49,25.39 IC3.94 | C21.1 30.09,15.54 L1.2 L1.1
  Top 0.4: 10.8,22.7 10.8,21.3 13.35,18.75 U$3.P$2 13.3,16.2 20.2,16.2 XVCC4.1 20.2,17.07 L1.1 | 10.8,22.7 10.8,23.1 | v44.4,22.5 44.25,22.8 42.9,24.15 37.8,24.15 36.9,23.25 36.9,22.05 v35.55,20.7 | XVCC3.1 10.86,22.64 10.8,22.7 | 4.25,36.82 2.97,38.1 1.7,38.1 1.2,37.6 1.2,32.1 6.6,26.7 6.6,26.2 9.7,23.1 10.8,23.1 | 10.8,23.1 10.8,32.8 12.4,34.4 16,34.4 17.7,36.1 SV9.2
  Bottom 0.3: IC1.3 63.25,33.2 61.5,34.95 58.05,34.95 | 54.63,34.95 58.05,34.95 | 54.63,34.95 C6.1 | IC1.8 58.17,35.07 58.05,34.95 | v44.4,22.5 44.4,24.14 C2.1 44.25,23.98 44.25,26.4 45,27.15 | v48.6,22.35 48.6,23.97 C7.1 48.75,24.24 v48.75,25.8 | 47.25,28.13 C8.1 45.98,28.13 45,27.15 | v46.35,34.5 46.35,33.37 C12.1 | 54.63,34.95 49.88,34.95 49.88,34.88 47.7,32.7 | v39.6,34.5 39.6,32.8 C14.1 | C13.1 C14.1 | C15.1 38.55,29.68 v38.55,30.9 38.55,31.01 C14.1 | v59.85,22.95 59.85,24.3 58.35,25.8 v48.75,25.8 | C12.1 46.69,30.68 46.65,30.72 46.65,30.59 C9.1 46.73,28.66 47.25,28.13 | v48.75,25.8 48,26.55 48,27.3 47.25,28.05 47.25,28.13 | SV5.4 39.47,2.68 38.25,3.9 36.75,3.9 36,4.65 v36,7.5 36,7.65 32.85,10.8 32.85,13.3 L1.1 29.1,17.05 | 47.7,32.7 47.25,32.7 C12.1 | 47.7,32.7 v49.35,32.7 | C12.1 46.65,32.85 | v42.6,34.5 42.6,32.26 C13.1 | C13.1 43.77,32.13 43.8,32.1 43.8,28.35 45,27.15 | v39.45,22.5 39.78,22.98 C16.1 39.78,24.87 v39,25.65 40.05,26.7 C17.1 | v36.3,17.1 31.65,17.1 L1.2
  Bottom 0.4: v35.55,20.7 35.25,20.4 27.9,20.4 27.15,19.65 27.15,18.6 28.68,17.07 L1.1
  Bottom 0.6: XVCC2.1 XVCC1.1

### Text on the board
Bottom: Minimatrix | Malte | Marwedel | (c)2014
tPlace: GND | GND | PE7 | PE4 | GND | GND
tNames: LED+ | Minimatrix | GND | VCC | VCC | PORTD | VCC | ANT | VCC | GND | GND | PDI | PB3 | 2.2 - 3.3V | JTAG | PB2 | - Bat + | - Solar + | - Sp + | TXD0 RXD0